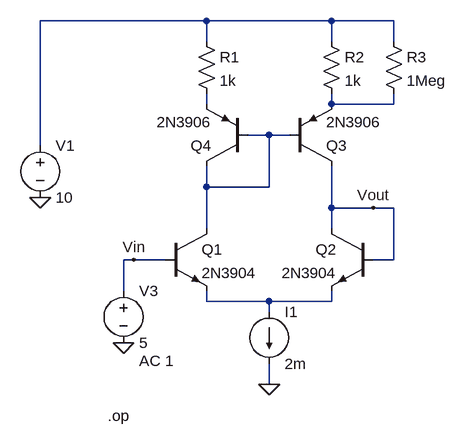
[diagram p0: schematic offset_nulling.asc]
offset_nulling.asc, the LTspice schematic file:
Version 4
SHEET 1 880 680
WIRE 80 -192 -176 -192
WIRE 272 -192 80 -192
WIRE 368 -192 272 -192
WIRE 80 -160 80 -192
WIRE 272 -160 272 -192
WIRE 368 -160 368 -192
WIRE 80 -64 80 -80
WIRE 272 -64 272 -80
WIRE 368 -64 368 -80
WIRE 368 -64 272 -64
WIRE 176 -16 144 -16
WIRE 208 -16 176 -16
WIRE -176 0 -176 -192
WIRE 80 64 80 32
WIRE 176 64 176 -16
WIRE 176 64 80 64
WIRE 272 96 272 32
WIRE 336 96 272 96
WIRE 368 96 336 96
WIRE 80 128 80 64
WIRE 272 128 272 96
WIRE -32 176 -48 176
WIRE 16 176 -32 176
WIRE 368 176 368 96
WIRE 368 176 336 176
WIRE -48 224 -48 176
WIRE 80 240 80 224
WIRE 176 240 80 240
WIRE 272 240 272 224
WIRE 272 240 176 240
WIRE 176 256 176 240
WIRE 176 368 176 336
FLAG 176 368 0
FLAG -176 80 0
FLAG -48 304 0
FLAG -32 176 Vin
FLAG 336 96 Vout
DATAFLAG 272 64 "Ic(Q2)"
DATAFLAG 80 96 "Ic(Q1)"
DATAFLAG 176 240 ""
DATAFLAG 512 48 "V(Vin)-V(Vout)"
SYMBOL npn 16 128 R0
SYMATTR InstName Q1
SYMATTR Value 2N3904
SYMBOL npn 336 128 M0
SYMATTR InstName Q2
SYMATTR Value 2N3904
SYMATTR SpiceLine m=2
SYMBOL pnp 208 32 M180
SYMATTR InstName Q3
SYMATTR Value 2N3906
SYMBOL pnp 144 32 R180
SYMATTR InstName Q4
SYMATTR Value 2N3906
SYMBOL current 176 256 R0
WINDOW 123 0 0 Left 0
WINDOW 39 0 0 Left 0
SYMATTR InstName I1
SYMATTR Value 2m
SYMBOL voltage -176 -16 R0
WINDOW 123 0 0 Left 0
WINDOW 39 0 0 Left 0
SYMATTR InstName V1
SYMATTR Value 10
SYMBOL voltage -48 208 R0
WINDOW 123 24 124 Left 2
WINDOW 39 0 0 Left 0
SYMATTR Value2 AC 1
SYMATTR InstName V3
SYMATTR Value 5
SYMBOL res 64 -176 R0
SYMATTR InstName R1
SYMATTR Value 1k
SYMBOL res 256 -176 R0
SYMATTR InstName R2
SYMATTR Value 1k
SYMBOL res 352 -176 R0
SYMATTR InstName R3
SYMATTR Value 1Meg
TEXT -72 416 Left 2 !.op

The netlist it stands for:
* offset_nulling.asc
Q1 N004 Vin N005 0 2N3904
Q2 Vout Vout N005 0 2N3904 m=2
Q3 Vout N004 N003 0 2N3906
Q4 N004 N004 N002 0 2N3906
I1 N005 0 2m
V1 N001 0 10
V3 Vin 0 5 AC 1
R1 N001 N002 1k
R2 N001 N003 1k
R3 N001 N003 1Meg
.model NPN NPN
.model PNP PNP
.lib standard.bjt
.op
.backanno
.end